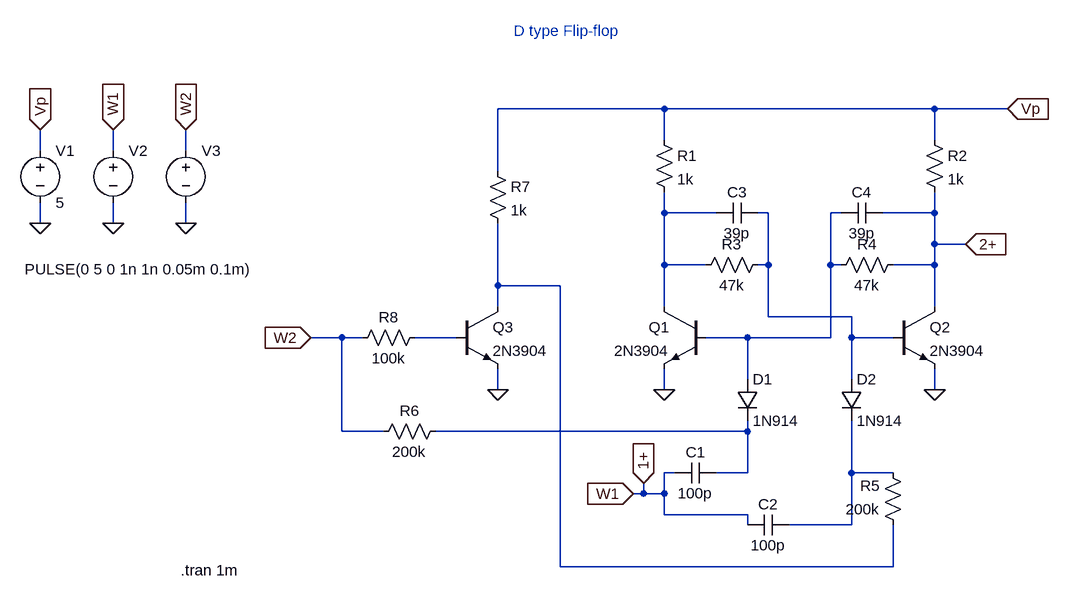
[diagram p0: schematic d_type_flipflop_ltspice.asc]
d_type_flipflop_ltspice.asc, the LTspice schematic file:
Version 4
SHEET 1 880 680
WIRE -16 -240 -272 -240
WIRE 400 -240 -16 -240
WIRE 512 -240 400 -240
WIRE -16 -192 -16 -240
WIRE 400 -192 400 -240
WIRE -976 -176 -976 -208
WIRE -864 -176 -864 -208
WIRE -752 -176 -752 -208
WIRE -272 -144 -272 -240
WIRE -16 -80 -16 -112
WIRE 64 -80 -16 -80
WIRE 144 -80 128 -80
WIRE 256 -80 240 -80
WIRE 400 -80 400 -112
WIRE 400 -80 320 -80
WIRE -976 -64 -976 -96
WIRE -864 -64 -864 -96
WIRE -752 -64 -752 -96
WIRE 400 -32 400 -80
WIRE 448 -32 400 -32
WIRE -16 0 -16 -80
WIRE 48 0 -16 0
WIRE 144 0 144 -80
WIRE 144 0 128 0
WIRE 240 0 240 -80
WIRE 256 0 240 0
WIRE 400 0 400 -32
WIRE 400 0 336 0
WIRE -272 32 -272 -64
WIRE -176 32 -272 32
WIRE -272 64 -272 32
WIRE -16 64 -16 0
WIRE 400 64 400 0
WIRE 144 80 144 0
WIRE 272 80 144 80
WIRE -512 112 -560 112
WIRE -480 112 -512 112
WIRE -336 112 -400 112
WIRE 112 112 48 112
WIRE 240 112 240 0
WIRE 240 112 112 112
WIRE 272 112 272 80
WIRE 336 112 272 112
WIRE 112 176 112 112
WIRE 272 176 272 112
WIRE -272 192 -272 160
WIRE -16 192 -16 160
WIRE 400 192 400 160
WIRE -512 256 -512 112
WIRE -448 256 -512 256
WIRE 112 256 112 240
WIRE 112 256 -368 256
WIRE 0 320 -16 320
WIRE 112 320 112 256
WIRE 112 320 64 320
WIRE 272 320 272 240
WIRE 336 320 272 320
WIRE -48 352 -48 336
WIRE -48 352 -64 352
WIRE -16 352 -16 320
WIRE -16 352 -48 352
WIRE -16 384 -16 352
WIRE 112 384 -16 384
WIRE 112 400 112 384
WIRE 272 400 272 320
WIRE 272 400 176 400
WIRE -176 464 -176 32
WIRE 336 464 336 400
WIRE 336 464 -176 464
FLAG -16 192 0
FLAG -272 192 0
FLAG 512 -240 Vp
IOPIN 512 -240 In
FLAG 448 -32 2+
IOPIN 448 -32 In
FLAG -560 112 W2
IOPIN -560 112 In
FLAG -64 352 W1
IOPIN -64 352 In
FLAG 400 192 0
FLAG -48 336 1+
IOPIN -48 336 In
FLAG -976 -64 0
FLAG -864 -64 0
FLAG -752 -64 0
FLAG -976 -208 Vp
IOPIN -976 -208 In
FLAG -864 -208 W1
IOPIN -864 -208 In
FLAG -752 -208 W2
IOPIN -752 -208 In
SYMBOL npn 48 64 M0
SYMATTR InstName Q1
SYMATTR Value 2N3904
SYMBOL npn 336 64 R0
SYMATTR InstName Q2
SYMATTR Value 2N3904
SYMBOL npn -336 64 R0
SYMATTR InstName Q3
SYMATTR Value 2N3904
SYMBOL res -32 -208 R0
SYMATTR InstName R1
SYMATTR Value 1k
SYMBOL res 384 -208 R0
SYMATTR InstName R2
SYMATTR Value 1k
SYMBOL res 144 -16 R90
WINDOW 0 0 56 VBottom 2
WINDOW 3 32 56 VTop 2
SYMATTR InstName R3
SYMATTR Value 47k
SYMBOL res 352 -16 R90
WINDOW 0 0 56 VBottom 2
WINDOW 3 32 56 VTop 2
SYMATTR InstName R4
SYMATTR Value 47k
SYMBOL res 352 416 R180
WINDOW 0 36 76 Left 2
WINDOW 3 36 40 Left 2
SYMATTR InstName R5
SYMATTR Value 200k
SYMBOL res -464 272 R270
WINDOW 0 32 56 VTop 2
WINDOW 3 0 56 VBottom 2
SYMATTR InstName R6
SYMATTR Value 200k
SYMBOL res -288 -160 R0
SYMATTR InstName R7
SYMATTR Value 1k
SYMBOL res -384 96 R90
WINDOW 0 0 56 VBottom 2
WINDOW 3 32 56 VTop 2
SYMATTR InstName R8
SYMATTR Value 100k
SYMBOL cap 64 304 R90
WINDOW 0 0 32 VBottom 2
WINDOW 3 32 32 VTop 2
SYMATTR InstName C1
SYMATTR Value 100p
SYMBOL cap 176 384 R90
WINDOW 0 0 32 VBottom 2
WINDOW 3 32 32 VTop 2
SYMATTR InstName C2
SYMATTR Value 100p
SYMBOL cap 128 -96 R90
WINDOW 0 0 32 VBottom 2
WINDOW 3 32 32 VTop 2
SYMATTR InstName C3
SYMATTR Value 39p
SYMBOL cap 320 -96 R90
WINDOW 0 0 32 VBottom 2
WINDOW 3 32 32 VTop 2
SYMATTR InstName C4
SYMATTR Value 39p
SYMBOL diode 96 176 R0
SYMATTR InstName D1
SYMATTR Value 1N914
SYMBOL diode 256 176 R0
SYMATTR InstName D2
SYMATTR Value 1N914
SYMBOL voltage -976 -192 R0
WINDOW 123 0 0 Left 0
WINDOW 39 0 0 Left 0
SYMATTR InstName V1
SYMATTR Value 5
SYMBOL voltage -864 -192 R0
WINDOW 3 -136 199 Left 2
WINDOW 123 0 0 Left 0
WINDOW 39 0 0 Left 0
SYMATTR InstName V2
SYMATTR Value PULSE(0 5 0 1n 1n 0.05m 0.1m)
SYMBOL voltage -752 -192 R0
WINDOW 3 24 44 Invisible 2
SYMATTR InstName V3
SYMATTR Value PWL REPEAT FOREVER (0 5 0.075m 5 0.075000001m 0 0.175m 0 0.175000001m 5 0.2m 5) ENDREPEAT
TEXT -760 470 Left 2 !.tran 1m
TEXT -248 -360 Left 2 ;D type Flip-flop

The netlist it stands for:
* d_type_flipflop_ltspice.asc
Q1 N001 N003 0 0 2N3904
Q2 2+ N002 0 0 2N3904
Q3 N004 N005 0 0 2N3904
R1 Vp N001 1k
R2 Vp 2+ 1k
R3 N002 N001 47k
R4 2+ N003 47k
R5 N004 N007 200k
R6 W2 N006 200k
R7 Vp N004 1k
R8 N005 W2 100k
C1 N006 1+ 100p
C2 N007 1+ 100p
C3 N002 N001 39p
C4 2+ N003 39p
D1 N003 N006 1N914
D2 N002 N007 1N914
V1 Vp 0 5
V2 1+ 0 PULSE(0 5 0 1n 1n 0.05m 0.1m)
V3 W2 0 PWL REPEAT FOREVER (0 5 0.075m 5 0.075000001m 0 0.175m 0 0.175000001m 5 0.2m 5) ENDREPEAT
.model D D
.lib standard.dio
.model NPN NPN
.model PNP PNP
.lib standard.bjt
.tran 1m
* D type Flip-flop
.backanno
.end